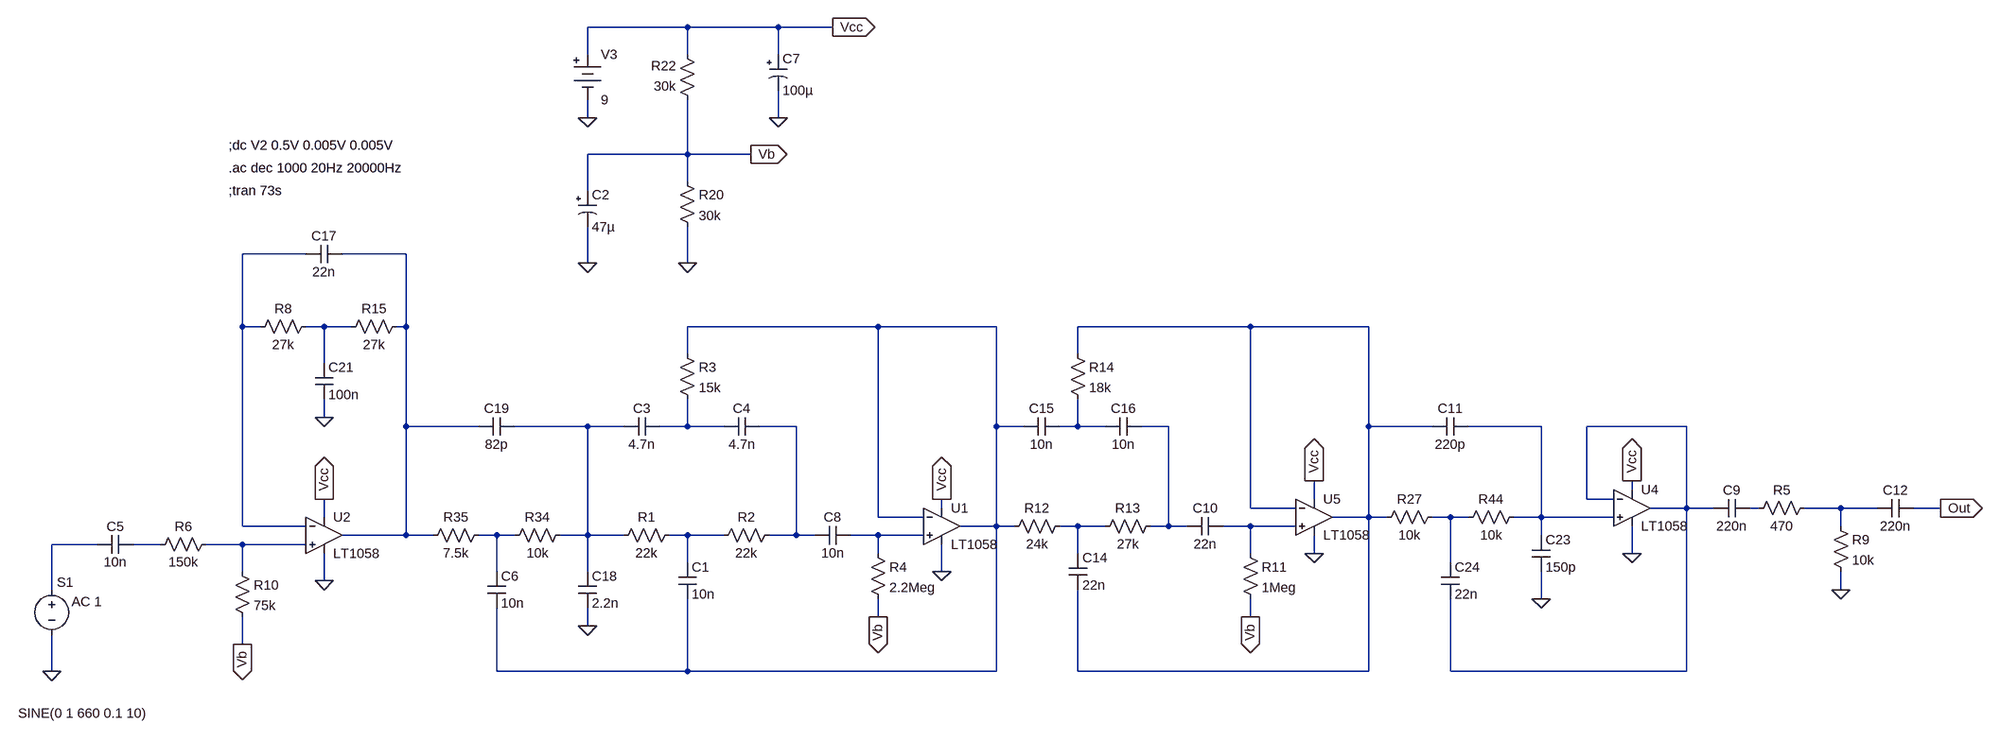
[diagram p0: schematic 4x12 V30 CabSim.asc]
4x12 V30 CabSim.asc, the LTspice schematic file:
Version 4
SHEET 1 2020 1684
WIRE -2832 -736 -3008 -736
WIRE -2672 -736 -2832 -736
WIRE -2576 -736 -2672 -736
WIRE -3008 -688 -3008 -736
WIRE -2832 -688 -2832 -736
WIRE -2672 -688 -2672 -736
WIRE -3008 -576 -3008 -608
WIRE -2672 -576 -2672 -624
WIRE -2832 -512 -2832 -608
WIRE -2832 -512 -3008 -512
WIRE -2720 -512 -2832 -512
WIRE -2832 -464 -2832 -512
WIRE -3008 -448 -3008 -512
WIRE -3504 -336 -3616 -336
WIRE -3328 -336 -3440 -336
WIRE -3008 -320 -3008 -384
WIRE -2832 -320 -2832 -384
WIRE -3616 -208 -3616 -336
WIRE -3584 -208 -3616 -208
WIRE -3472 -208 -3504 -208
WIRE -3424 -208 -3472 -208
WIRE -3328 -208 -3328 -336
WIRE -3328 -208 -3344 -208
WIRE -2496 -208 -2832 -208
WIRE -2288 -208 -2496 -208
WIRE -1840 -208 -2144 -208
WIRE -1632 -208 -1840 -208
WIRE -2832 -160 -2832 -208
WIRE -2144 -160 -2144 -208
WIRE -3472 -144 -3472 -208
WIRE -3472 -48 -3472 -80
WIRE -3328 -32 -3328 -208
WIRE -3200 -32 -3328 -32
WIRE -3008 -32 -3136 -32
WIRE -2944 -32 -3008 -32
WIRE -2832 -32 -2832 -80
WIRE -2832 -32 -2880 -32
WIRE -2768 -32 -2832 -32
WIRE -2640 -32 -2704 -32
WIRE -2288 -32 -2288 -208
WIRE -2240 -32 -2288 -32
WIRE -2144 -32 -2144 -80
WIRE -2144 -32 -2176 -32
WIRE -2096 -32 -2144 -32
WIRE -1984 -32 -2032 -32
WIRE -1632 -32 -1632 -208
WIRE -1520 -32 -1632 -32
WIRE -1328 -32 -1456 -32
WIRE -1072 -32 -1248 -32
WIRE -1168 80 -1168 64
WIRE -1728 96 -1728 64
WIRE -1248 96 -1248 -32
WIRE -1200 96 -1248 96
WIRE -2384 112 -2384 96
WIRE -1840 112 -1840 -208
WIRE -1760 112 -1840 112
WIRE -1072 112 -1072 -32
WIRE -1072 112 -1136 112
WIRE -1024 112 -1072 112
WIRE -944 112 -960 112
WIRE -800 112 -864 112
WIRE -736 112 -800 112
WIRE -624 112 -672 112
WIRE -3472 128 -3472 96
WIRE -2496 128 -2496 -208
WIRE -2416 128 -2496 128
WIRE -1632 128 -1632 -32
WIRE -1632 128 -1696 128
WIRE -1600 128 -1632 128
WIRE -1488 128 -1520 128
WIRE -1456 128 -1488 128
WIRE -1328 128 -1328 -32
WIRE -1328 128 -1376 128
WIRE -1200 128 -1328 128
WIRE -3616 144 -3616 -208
WIRE -3504 144 -3616 144
WIRE -2288 144 -2288 -32
WIRE -2288 144 -2352 144
WIRE -2256 144 -2288 144
WIRE -2144 144 -2176 144
WIRE -2096 144 -2144 144
WIRE -1984 144 -1984 -32
WIRE -1984 144 -2016 144
WIRE -1952 144 -1984 144
WIRE -1840 144 -1888 144
WIRE -1760 144 -1840 144
WIRE -800 144 -800 112
WIRE -3328 160 -3328 -32
WIRE -3328 160 -3440 160
WIRE -3280 160 -3328 160
WIRE -3168 160 -3200 160
WIRE -3136 160 -3168 160
WIRE -3008 160 -3008 -32
WIRE -3008 160 -3056 160
WIRE -2944 160 -3008 160
WIRE -2832 160 -2864 160
WIRE -2768 160 -2832 160
WIRE -2640 160 -2640 -32
WIRE -2640 160 -2688 160
WIRE -2608 160 -2640 160
WIRE -2496 160 -2544 160
WIRE -2416 160 -2496 160
WIRE -1328 160 -1328 128
WIRE -3872 176 -3952 176
WIRE -3760 176 -3808 176
WIRE -3616 176 -3680 176
WIRE -3504 176 -3616 176
WIRE -2496 192 -2496 160
WIRE -2144 192 -2144 144
WIRE -1840 192 -1840 144
WIRE -1728 192 -1728 160
WIRE -1168 192 -1168 144
WIRE -2832 208 -2832 160
WIRE -1488 208 -1488 128
WIRE -3616 224 -3616 176
WIRE -3168 224 -3168 160
WIRE -3008 224 -3008 160
WIRE -2384 224 -2384 176
WIRE -3472 240 -3472 192
WIRE -3952 256 -3952 176
WIRE -800 256 -800 224
WIRE -1328 272 -1328 224
WIRE -2496 304 -2496 272
WIRE -1840 304 -1840 272
WIRE -3008 320 -3008 288
WIRE -3616 352 -3616 304
WIRE -3952 400 -3952 336
WIRE -3168 400 -3168 288
WIRE -2832 400 -2832 272
WIRE -2832 400 -3168 400
WIRE -2288 400 -2288 144
WIRE -2288 400 -2832 400
WIRE -2144 400 -2144 256
WIRE -1632 400 -1632 128
WIRE -1632 400 -2144 400
WIRE -1488 400 -1488 272
WIRE -1072 400 -1072 112
WIRE -1072 400 -1488 400
FLAG -624 112 Out
IOPIN -624 112 Out
FLAG -3008 -576 0
FLAG -2832 -320 0
FLAG -2720 -512 Vb
IOPIN -2720 -512 Out
FLAG -2576 -736 Vcc
IOPIN -2576 -736 Out
FLAG -1328 272 0
FLAG -1168 192 0
FLAG -1168 64 Vcc
IOPIN -1168 64 Out
FLAG -2384 224 0
FLAG -2384 96 Vcc
IOPIN -2384 96 Out
FLAG -2496 304 Vb
IOPIN -2496 304 Out
FLAG -3472 240 0
FLAG -3472 96 Vcc
IOPIN -3472 96 Out
FLAG -3616 352 Vb
IOPIN -3616 352 Out
FLAG -3008 320 0
FLAG -1728 64 Vcc
IOPIN -1728 64 Out
FLAG -1728 192 0
FLAG -1840 304 Vb
IOPIN -1840 304 Out
FLAG -800 256 0
FLAG -2672 -576 0
FLAG -3472 -48 0
FLAG -3952 400 0
FLAG -3008 -320 0
SYMBOL res -2848 -480 R0
SYMATTR InstName R20
SYMATTR Value 30k
SYMBOL res -2816 -592 R180
WINDOW 0 36 76 Left 2
WINDOW 3 36 40 Left 2
SYMATTR InstName R22
SYMATTR Value 30k
SYMBOL Misc\\battery -3008 -704 R0
WINDOW 123 0 0 Left 2
WINDOW 39 0 0 Left 2
SYMATTR InstName V3
SYMATTR Value 9
SYMBOL polcap -3024 -448 R0
WINDOW 3 24 64 Left 2
SYMATTR Value 47µ
SYMATTR InstName C2
SYMATTR Description Capacitor
SYMATTR Type cap
SYMATTR SpiceLine V=25 Irms=60m Rser=2.4 Lser=0
SYMBOL res -1504 112 R90
WINDOW 0 0 56 VBottom 2
WINDOW 3 32 56 VTop 2
SYMATTR InstName R27
SYMATTR Value 10k
SYMBOL cap -1456 -48 R90
WINDOW 0 0 32 VBottom 2
WINDOW 3 32 32 VTop 2
SYMATTR InstName C11
SYMATTR Value 220p
SYMBOL cap -1344 160 R0
SYMATTR InstName C23
SYMATTR Value 150p
SYMBOL res -1360 112 R90
WINDOW 0 0 56 VBottom 2
WINDOW 3 32 56 VTop 2
SYMATTR InstName R44
SYMATTR Value 10k
SYMBOL cap -1504 208 R0
SYMATTR InstName C24
SYMATTR Value 22n
SYMBOL res -2848 144 R90
WINDOW 0 0 56 VBottom 2
WINDOW 3 32 56 VTop 2
SYMATTR InstName R1
SYMATTR Value 22k
SYMBOL res -2672 144 R90
WINDOW 0 0 56 VBottom 2
WINDOW 3 32 56 VTop 2
SYMATTR InstName R2
SYMATTR Value 22k
SYMBOL cap -2848 208 R0
SYMATTR InstName C1
SYMATTR Value 10n
SYMBOL cap -2880 -48 R90
WINDOW 0 0 32 VBottom 2
WINDOW 3 32 32 VTop 2
SYMATTR InstName C3
SYMATTR Value 4.7n
SYMBOL cap -2704 -48 R90
WINDOW 0 0 32 VBottom 2
WINDOW 3 32 32 VTop 2
SYMATTR InstName C4
SYMATTR Value 4.7n
SYMBOL res -2848 -176 R0
SYMATTR InstName R3
SYMATTR Value 15k
SYMBOL res -2512 176 R0
SYMATTR InstName R4
SYMATTR Value 2.2Meg
SYMBOL cap -3808 160 R90
WINDOW 0 0 32 VBottom 2
WINDOW 3 32 32 VTop 2
SYMATTR InstName C5
SYMATTR Value 10n
SYMATTR SpiceLine V=16 Irms=0 Rser=0.007 Lser=0
SYMBOL res -1856 176 R0
SYMATTR InstName R11
SYMATTR Value 1Meg
SYMBOL res -2160 128 R90
WINDOW 0 0 56 VBottom 2
WINDOW 3 32 56 VTop 2
SYMATTR InstName R12
SYMATTR Value 24k
SYMBOL res -2000 128 R90
WINDOW 0 0 56 VBottom 2
WINDOW 3 32 56 VTop 2
SYMATTR InstName R13
SYMATTR Value 27k
SYMBOL cap -2160 192 R0
SYMATTR InstName C14
SYMATTR Value 22n
SYMBOL cap -2176 -48 R90
WINDOW 0 0 32 VBottom 2
WINDOW 3 32 32 VTop 2
SYMATTR InstName C15
SYMATTR Value 10n
SYMBOL cap -2032 -48 R90
WINDOW 0 0 32 VBottom 2
WINDOW 3 32 32 VTop 2
SYMATTR InstName C16
SYMATTR Value 10n
SYMBOL res -2160 -176 R0
SYMATTR InstName R14
SYMATTR Value 18k
SYMBOL cap -3440 -352 R90
WINDOW 0 0 32 VBottom 2
WINDOW 3 32 32 VTop 2
SYMATTR InstName C17
SYMATTR Value 22n
SYMBOL res -3040 144 R90
WINDOW 0 0 56 VBottom 2
WINDOW 3 32 56 VTop 2
SYMATTR InstName R34
SYMATTR Value 10k
SYMBOL res -3184 144 R90
WINDOW 0 0 56 VBottom 2
WINDOW 3 32 56 VTop 2
SYMATTR InstName R35
SYMATTR Value 7.5k
SYMBOL cap -3184 224 R0
SYMATTR InstName C6
SYMATTR Value 10n
SYMBOL cap -3024 224 R0
SYMATTR InstName C18
SYMATTR Value 2.2n
SYMBOL cap -3136 -48 R90
WINDOW 0 0 32 VBottom 2
WINDOW 3 32 32 VTop 2
SYMATTR InstName C19
SYMATTR Value 82p
SYMBOL Opamps\\LT1058 -1728 64 R0
SYMATTR InstName U5
SYMBOL Opamps\\LT1058 -2384 80 R0
SYMATTR InstName U1
SYMBOL Opamps\\LT1058 -3472 96 R0
SYMATTR InstName U2
SYMBOL Opamps\\LT1058 -1168 48 R0
SYMATTR InstName U4
SYMBOL res -816 128 R0
SYMATTR InstName R9
SYMATTR Value 10k
SYMBOL polcap -2688 -688 R0
WINDOW 3 24 64 Left 2
SYMATTR Value 100µ
SYMATTR InstName C7
SYMATTR Description Capacitor
SYMATTR Type cap
SYMATTR SpiceLine V=2.5 Irms=1.1 Rser=0.07 Lser=0
SYMBOL cap -1888 128 R90
WINDOW 0 0 32 VBottom 2
WINDOW 3 32 32 VTop 2
SYMATTR InstName C10
SYMATTR Value 22n
SYMBOL cap -2544 144 R90
WINDOW 0 0 32 VBottom 2
WINDOW 3 32 32 VTop 2
SYMATTR InstName C8
SYMATTR Value 10n
SYMBOL res -3488 -224 R90
WINDOW 0 0 56 VBottom 2
WINDOW 3 32 56 VTop 2
SYMATTR InstName R8
SYMATTR Value 27k
SYMBOL res -3328 -224 R90
WINDOW 0 0 56 VBottom 2
WINDOW 3 32 56 VTop 2
SYMATTR InstName R15
SYMATTR Value 27k
SYMBOL cap -3488 -144 R0
SYMATTR InstName C21
SYMATTR Value 100n
SYMBOL res -3632 208 R0
SYMATTR InstName R10
SYMATTR Value 75k
SYMBOL cap -960 96 R90
WINDOW 0 0 32 VBottom 2
WINDOW 3 32 32 VTop 2
SYMATTR InstName C9
SYMATTR Value 220n
SYMBOL cap -672 96 R90
WINDOW 0 0 32 VBottom 2
WINDOW 3 32 32 VTop 2
SYMATTR InstName C12
SYMATTR Value 220n
SYMBOL voltage -3952 240 R0
WINDOW 123 35 37 Left 2
WINDOW 39 0 0 Left 2
WINDOW 3 -59 234 Left 2
WINDOW 0 9 3 Left 2
SYMATTR Value2 AC 1
SYMATTR Value SINE(0 1 660 0.1 10)
SYMATTR InstName S1
SYMBOL res -848 96 R90
WINDOW 0 0 56 VBottom 2
WINDOW 3 32 56 VTop 2
SYMATTR InstName R5
SYMATTR Value 470
SYMBOL res -3664 160 R90
WINDOW 0 0 56 VBottom 2
WINDOW 3 32 56 VTop 2
SYMATTR InstName R6
SYMATTR Value 150k
TEXT -3640 -448 Left 2 !;tran 73s
TEXT -3640 -528 Left 2 !;dc V2 0.5V 0.005V 0.005V
TEXT -3640 -488 Left 2 !.ac dec 1000 20Hz 20000Hz

The netlist it stands for:
* 4x12 V30 CabSim.asc
R20 Vb 0 30k
R22 Vb Vcc 30k
V3 Vcc 0 9
C2 Vb 0 47µ V=25 Irms=60m Rser=2.4 Lser=0
R27 N015 N005 10k
C11 N011 N005 220p
C23 N011 0 150p
R44 N011 N015 10k
C24 N015 N012 22n
R1 N019 N006 22k
R2 N008 N019 22k
C1 N019 N004 10n
C3 N007 N006 4.7n
C4 N008 N007 4.7n
R3 N004 N007 15k
R4 N020 Vb 2.2Meg
C5 N022 N021 10n V=16 Irms=0 Rser=0.007 Lser=0
R11 N017 Vb 1Meg
R12 N016 N004 24k
R13 N010 N016 27k
C14 N016 N005 22n
C15 N009 N004 10n
C16 N010 N009 10n
R14 N005 N009 18k
C17 N002 N001 22n
R34 N006 N018 10k
R35 N018 N002 7.5k
C6 N018 N004 10n
C18 N006 0 2.2n
C19 N006 N002 82p
XU5 N017 N005 Vcc 0 N005 LT1057  ; LT1058, pins In+ In- V+ V- OUT
XU1 N020 N004 Vcc 0 N004 LT1057  ; LT1058, pins In+ In- V+ V- OUT
XU2 N023 N001 Vcc 0 N002 LT1057  ; LT1058, pins In+ In- V+ V- OUT
XU4 N011 N012 Vcc 0 N012 LT1057  ; LT1058, pins In+ In- V+ V- OUT
R9 N014 0 10k
C7 Vcc 0 100µ V=2.5 Irms=1.1 Rser=0.07 Lser=0
C10 N017 N010 22n
C8 N020 N008 10n
R8 N003 N001 27k
R15 N002 N003 27k
C21 N003 0 100n
R10 N023 Vb 75k
C9 N013 N012 220n
C12 Out N014 220n
V§S1 N021 0 SINE(0 1 660 0.1 10) AC 1
R5 N014 N013 470
R6 N023 N022 150k
;tran 73s
;dc V2 0.5V 0.005V 0.005V
.ac dec 1000 20Hz 20000Hz
.lib LTC.lib
.backanno
.end